# Altium schematic sheet FPGA.SchDoc
size D; DocumentNumber: 4; SheetNumber: 4; SheetTotal: 8
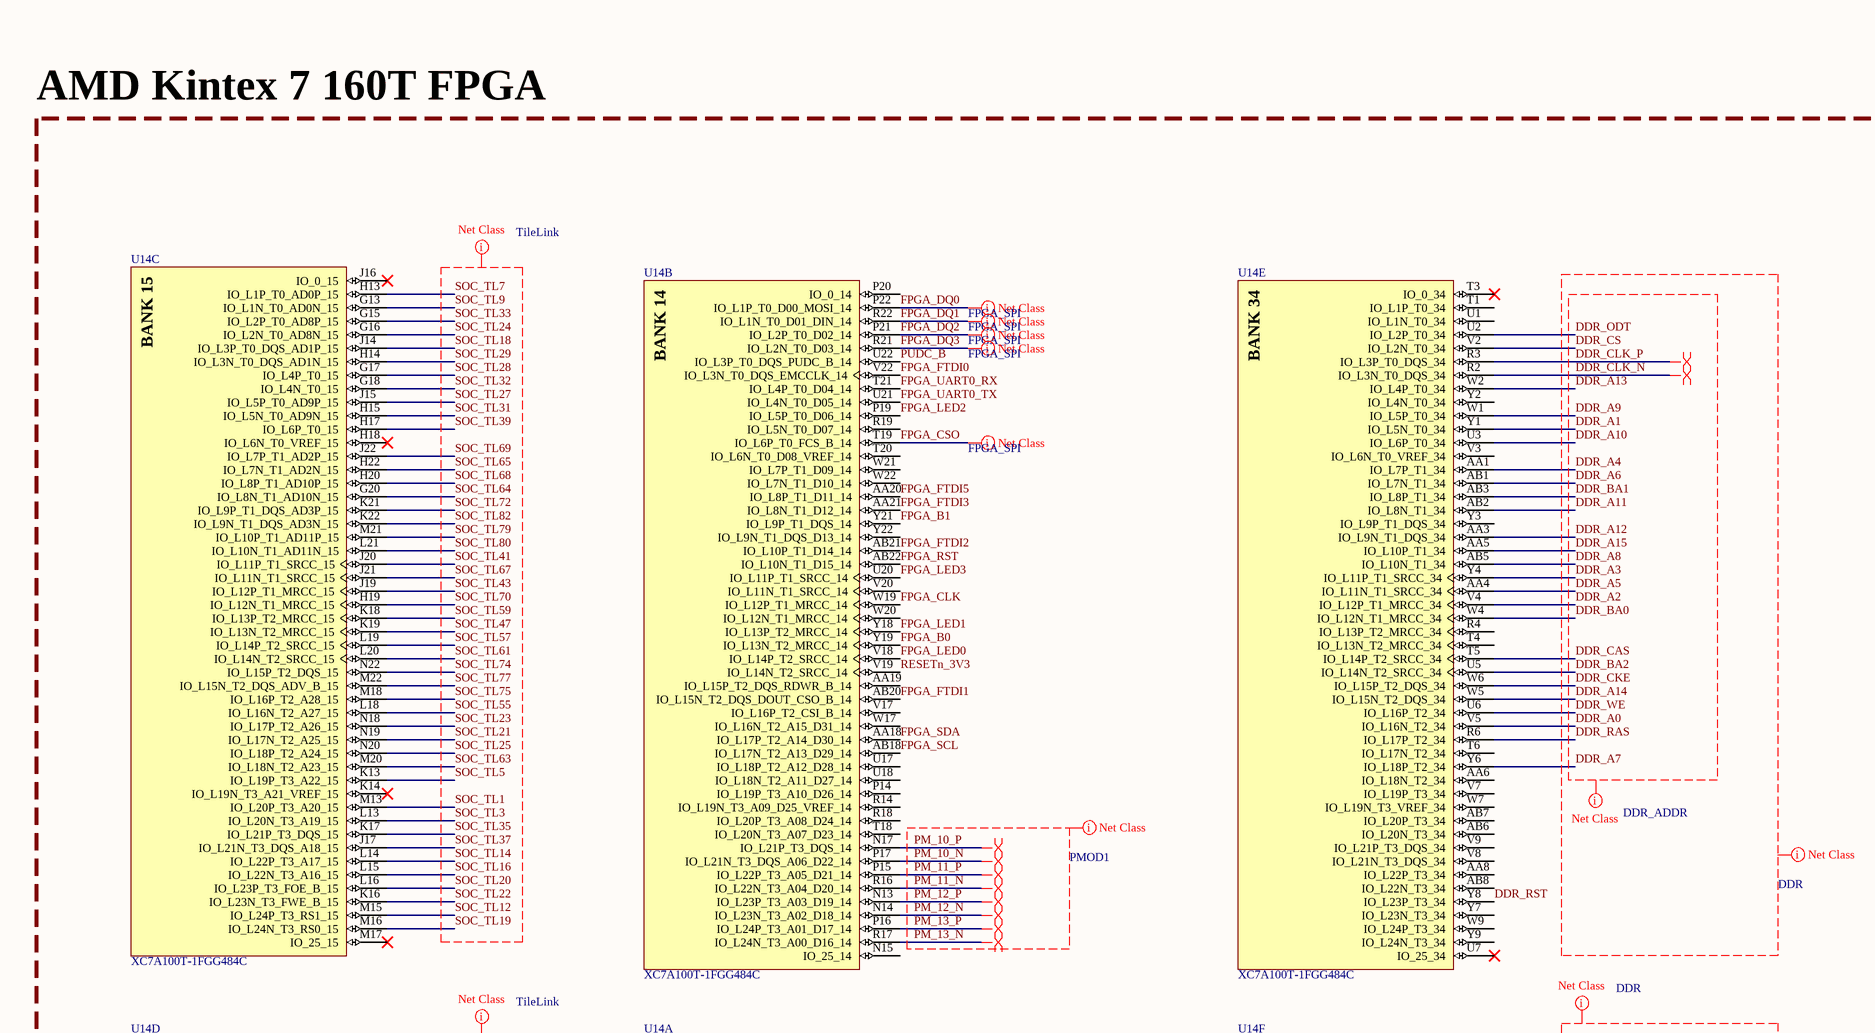
[diagram p0: FPGA.SchDoc, top left]
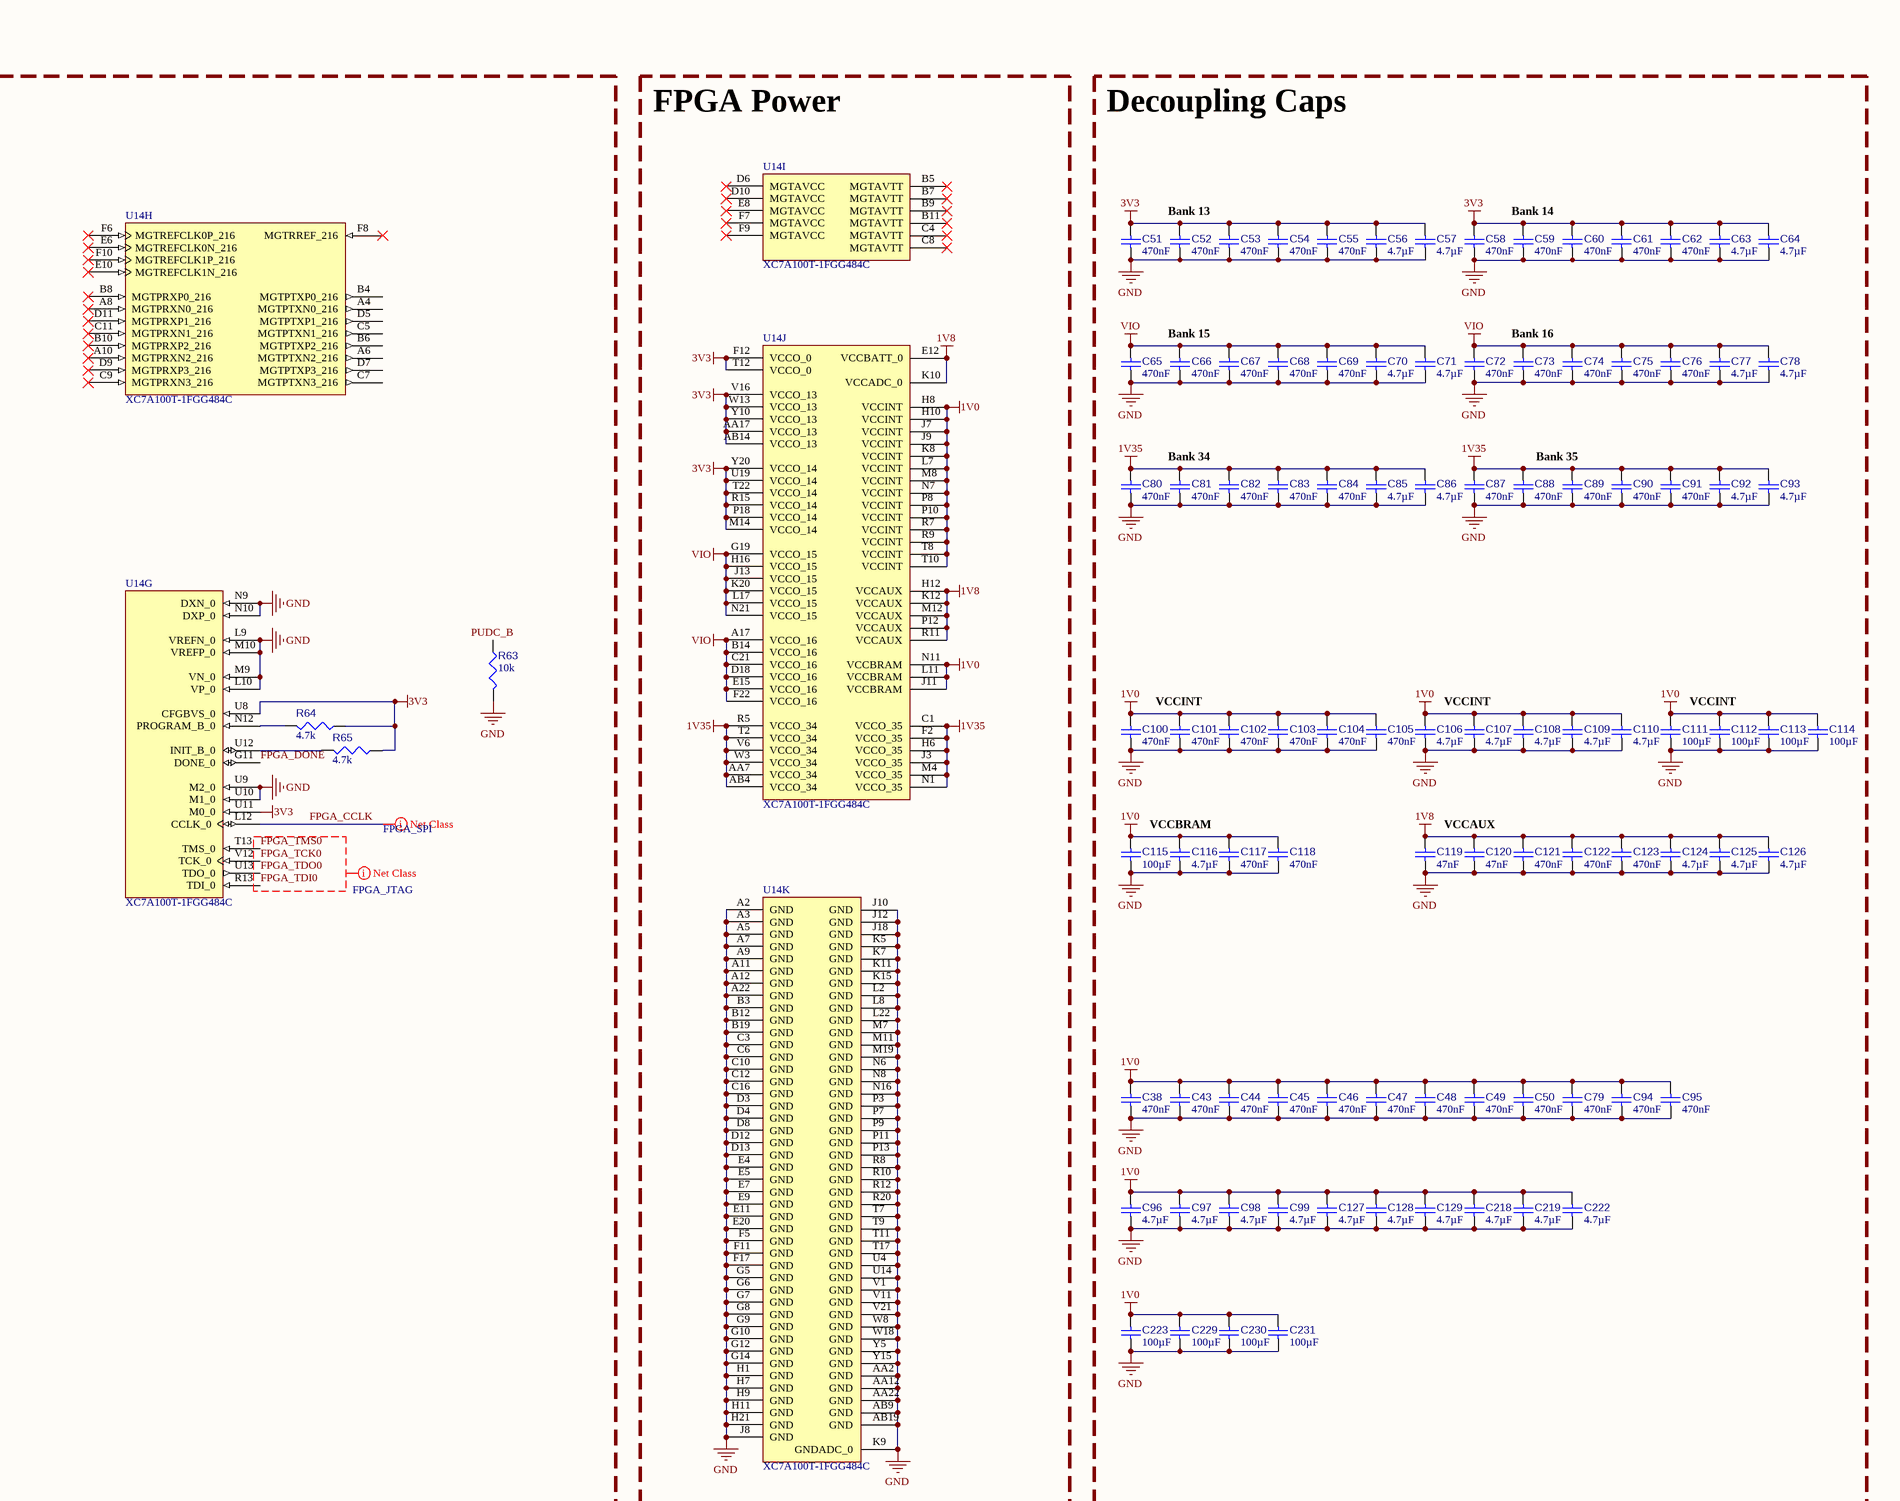
[diagram p1: FPGA.SchDoc, top right]
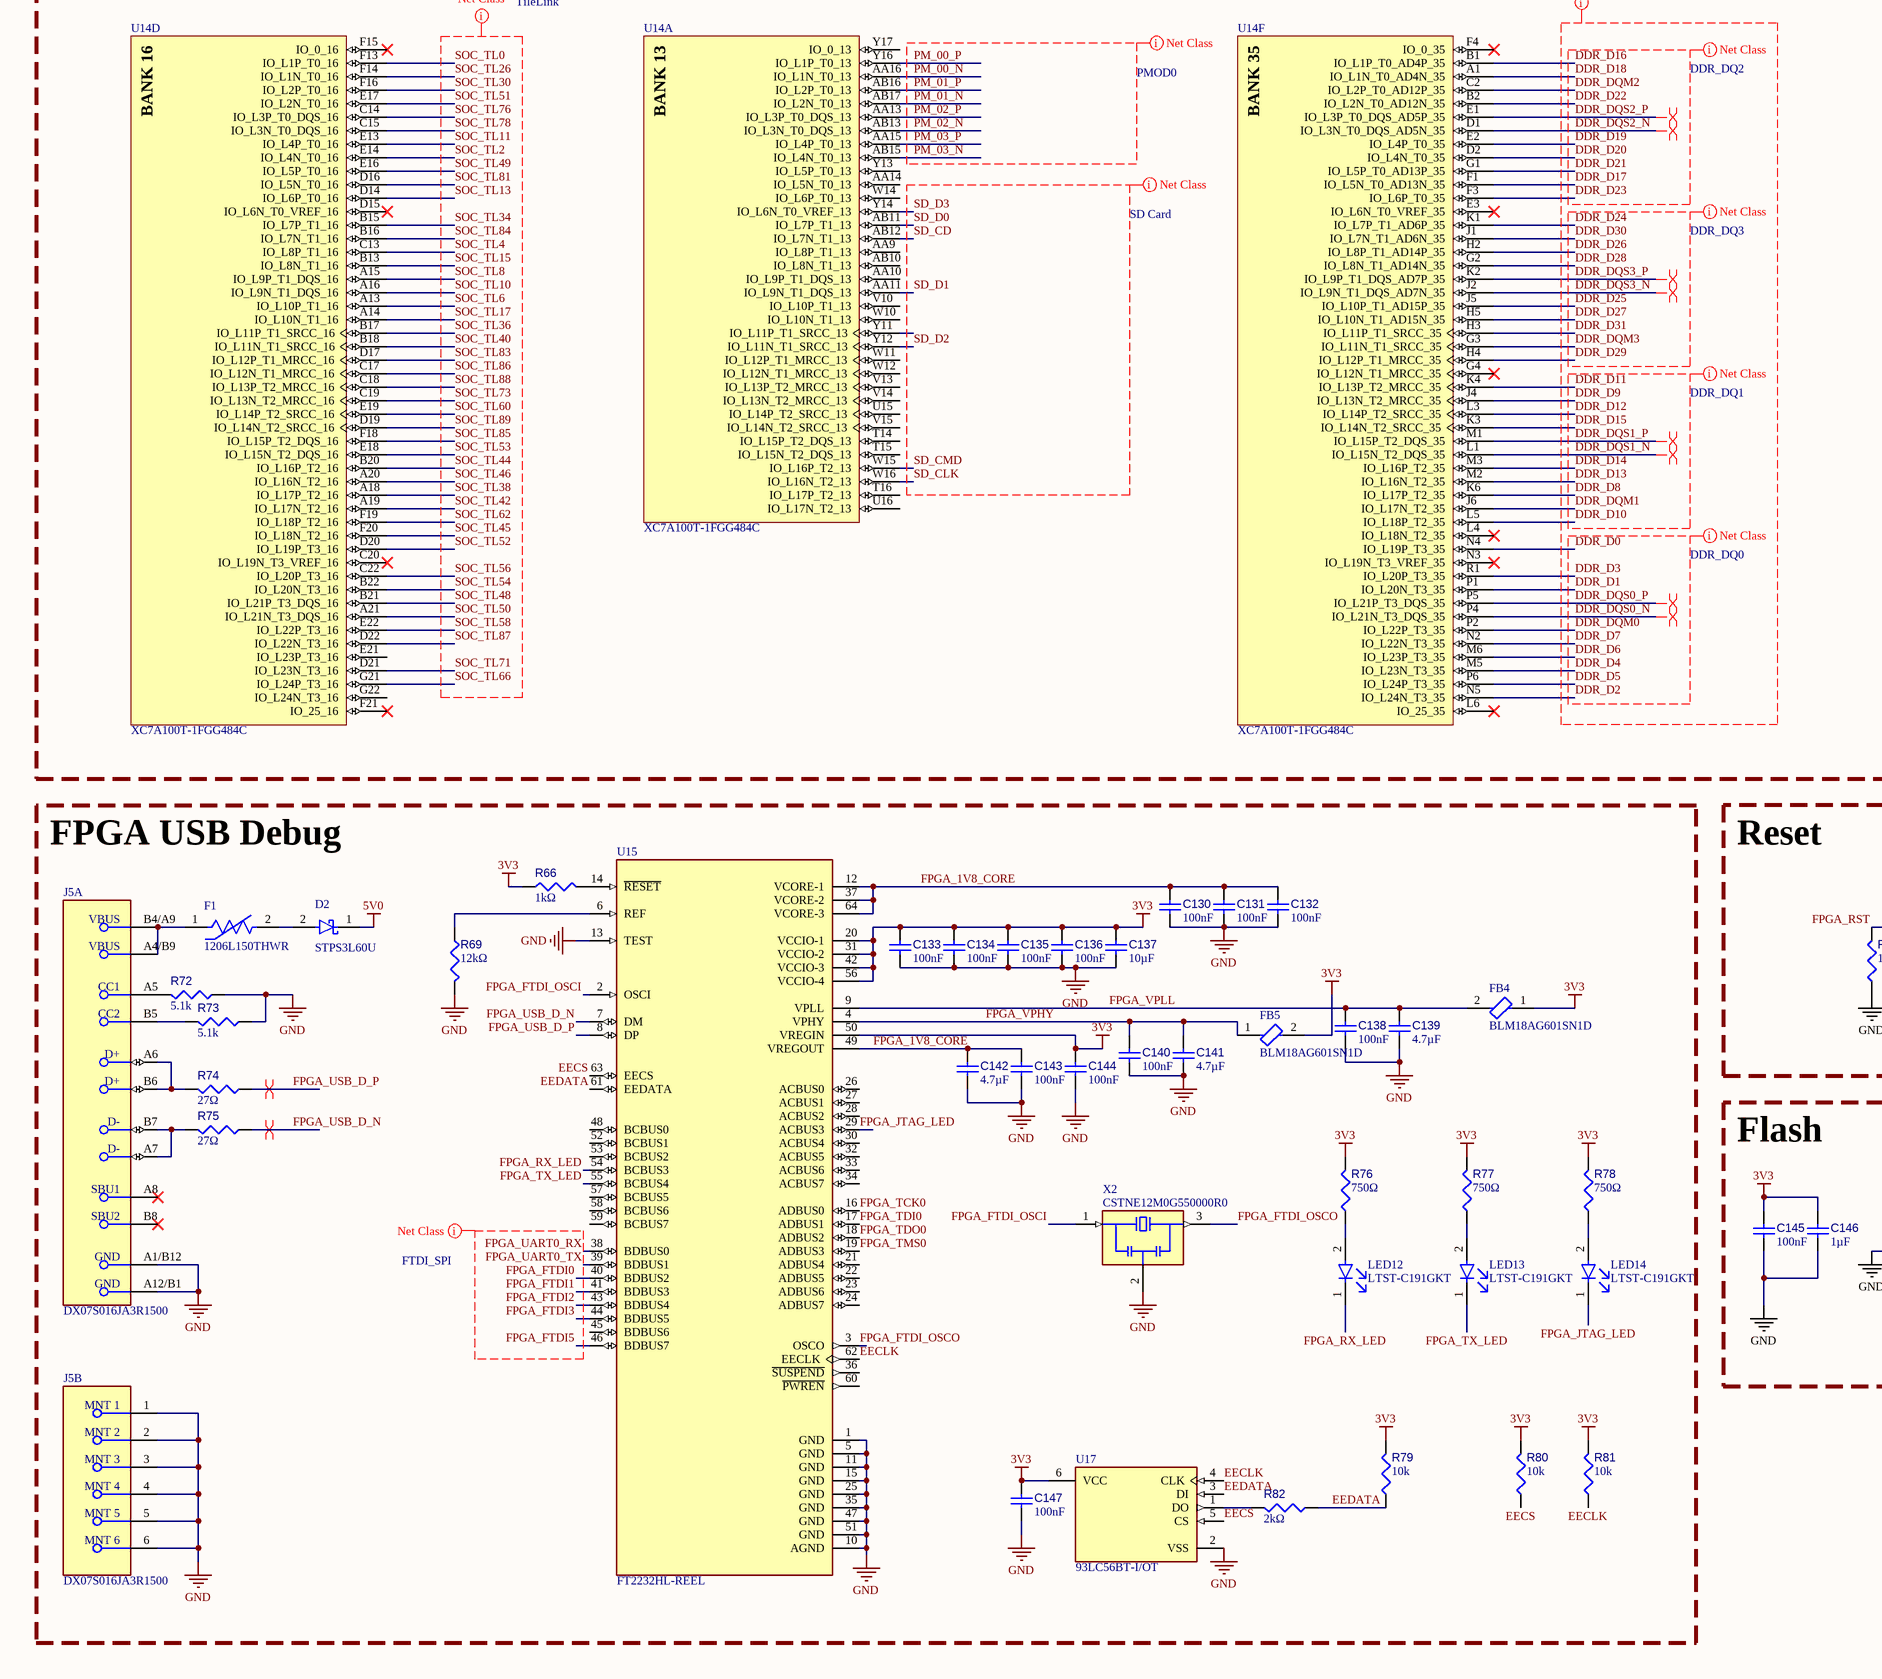
[diagram p2: FPGA.SchDoc, bottom left]
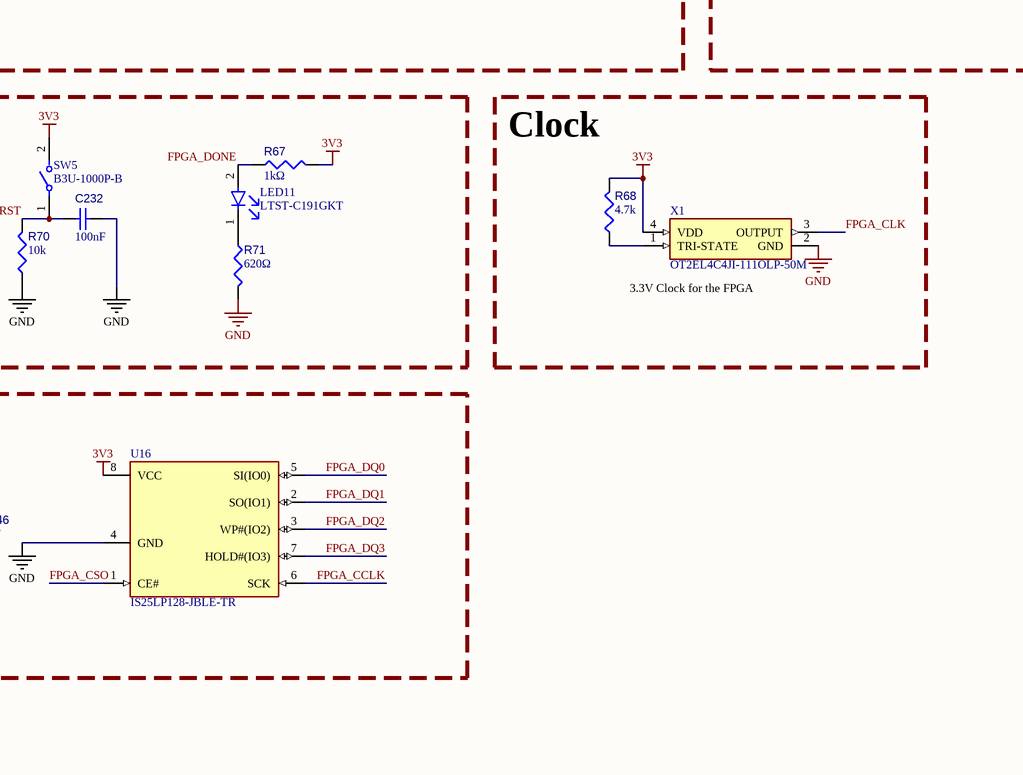
[diagram p3: FPGA.SchDoc, bottom right]

## Parts
C38  value 470nF  [CAP-0402-MFG]  (hidden comment: GRT155R61C474KE01D)
C43  value 470nF  [CAP-0402-MFG]  (hidden comment: GRT155R61C474KE01D)
C44  value 470nF  [CAP-0402-MFG]  (hidden comment: GRT155R61C474KE01D)
C45  value 470nF  [CAP-0402-MFG]  (hidden comment: GRT155R61C474KE01D)
C46  value 470nF  [CAP-0402-MFG]  (hidden comment: GRT155R61C474KE01D)
C47  value 470nF  [CAP-0402-MFG]  (hidden comment: GRT155R61C474KE01D)
C48  value 470nF  [CAP-0402-MFG]  (hidden comment: GRT155R61C474KE01D)
C49  value 470nF  [CAP-0402-MFG]  (hidden comment: GRT155R61C474KE01D)
C50  value 470nF  [CAP-0402-MFG]  (hidden comment: GRT155R61C474KE01D)
C51  value 470nF  [CAP-0402-MFG]  (hidden comment: GRT155R61C474KE01D)
C52  value 470nF  [CAP-0402-MFG]  (hidden comment: GRT155R61C474KE01D)
C53  value 470nF  [CAP-0402-MFG]  (hidden comment: GRT155R61C474KE01D)
C54  value 470nF  [CAP-0402-MFG]  (hidden comment: GRT155R61C474KE01D)
C55  value 470nF  [CAP-0402-MFG]  (hidden comment: GRT155R61C474KE01D)
C56  value 4.7µF  [CAP-0402-MFG]  (hidden comment: GRM155R61E475ME15D)
C57  value 4.7µF  [CAP-0402-MFG]  (hidden comment: GRM155R61E475ME15D)
C58  value 470nF  [CAP-0402-MFG]  (hidden comment: GRT155R61C474KE01D)
C59  value 470nF  [CAP-0402-MFG]  (hidden comment: GRT155R61C474KE01D)
C60  value 470nF  [CAP-0402-MFG]  (hidden comment: GRT155R61C474KE01D)
C61  value 470nF  [CAP-0402-MFG]  (hidden comment: GRT155R61C474KE01D)
C62  value 470nF  [CAP-0402-MFG]  (hidden comment: GRT155R61C474KE01D)
C63  value 4.7µF  [CAP-0402-MFG]  (hidden comment: GRM155R61E475ME15D)
C64  value 4.7µF  [CAP-0402-MFG]  (hidden comment: GRM155R61E475ME15D)
C65  value 470nF  [CAP-0402-MFG]  (hidden comment: GRT155R61C474KE01D)
C66  value 470nF  [CAP-0402-MFG]  (hidden comment: GRT155R61C474KE01D)
C67  value 470nF  [CAP-0402-MFG]  (hidden comment: GRT155R61C474KE01D)
C68  value 470nF  [CAP-0402-MFG]  (hidden comment: GRT155R61C474KE01D)
C69  value 470nF  [CAP-0402-MFG]  (hidden comment: GRT155R61C474KE01D)
C70  value 4.7µF  [CAP-0402-MFG]  (hidden comment: GRM155R61E475ME15D)
C71  value 4.7µF  [CAP-0402-MFG]  (hidden comment: GRM155R61E475ME15D)
C72  value 470nF  [CAP-0402-MFG]  (hidden comment: GRT155R61C474KE01D)
C73  value 470nF  [CAP-0402-MFG]  (hidden comment: GRT155R61C474KE01D)
C74  value 470nF  [CAP-0402-MFG]  (hidden comment: GRT155R61C474KE01D)
C75  value 470nF  [CAP-0402-MFG]  (hidden comment: GRT155R61C474KE01D)
C76  value 470nF  [CAP-0402-MFG]  (hidden comment: GRT155R61C474KE01D)
C77  value 4.7µF  [CAP-0402-MFG]  (hidden comment: GRM155R61E475ME15D)
C78  value 4.7µF  [CAP-0402-MFG]  (hidden comment: GRM155R61E475ME15D)
C79  value 470nF  [CAP-0402-MFG]  (hidden comment: GRT155R61C474KE01D)
C80  value 470nF  [CAP-0402-MFG]  (hidden comment: GRT155R61C474KE01D)
C81  value 470nF  [CAP-0402-MFG]  (hidden comment: GRT155R61C474KE01D)
C82  value 470nF  [CAP-0402-MFG]  (hidden comment: GRT155R61C474KE01D)
C83  value 470nF  [CAP-0402-MFG]  (hidden comment: GRT155R61C474KE01D)
C84  value 470nF  [CAP-0402-MFG]  (hidden comment: GRT155R61C474KE01D)
C85  value 4.7µF  [CAP-0402-MFG]  (hidden comment: GRM155R61E475ME15D)
C86  value 4.7µF  [CAP-0402-MFG]  (hidden comment: GRM155R61E475ME15D)
C87  value 470nF  [CAP-0402-MFG]  (hidden comment: GRT155R61C474KE01D)
C88  value 470nF  [CAP-0402-MFG]  (hidden comment: GRT155R61C474KE01D)
C89  value 470nF  [CAP-0402-MFG]  (hidden comment: GRT155R61C474KE01D)
C90  value 470nF  [CAP-0402-MFG]  (hidden comment: GRT155R61C474KE01D)
C91  value 470nF  [CAP-0402-MFG]  (hidden comment: GRT155R61C474KE01D)
C92  value 4.7µF  [CAP-0402-MFG]  (hidden comment: GRM155R61E475ME15D)
C93  value 4.7µF  [CAP-0402-MFG]  (hidden comment: GRM155R61E475ME15D)
C94  value 470nF  [CAP-0402-MFG]  (hidden comment: GRT155R61C474KE01D)
C95  value 470nF  [CAP-0402-MFG]  (hidden comment: GRT155R61C474KE01D)
C96  value 4.7µF  [CAP-0402-MFG]  (hidden comment: GRM155R61E475ME15D)
C97  value 4.7µF  [CAP-0402-MFG]  (hidden comment: GRM155R61E475ME15D)
C98  value 4.7µF  [CAP-0402-MFG]  (hidden comment: GRM155R61E475ME15D)
C99  value 4.7µF  [CAP-0402-MFG]  (hidden comment: GRM155R61E475ME15D)
C100  value 470nF  [CAP-0402-MFG]  (hidden comment: GRT155R61C474KE01D)
C101  value 470nF  [CAP-0402-MFG]  (hidden comment: GRT155R61C474KE01D)
C102  value 470nF  [CAP-0402-MFG]  (hidden comment: GRT155R61C474KE01D)
C103  value 470nF  [CAP-0402-MFG]  (hidden comment: GRT155R61C474KE01D)
C104  value 470nF  [CAP-0402-MFG]  (hidden comment: GRT155R61C474KE01D)
C105  value 470nF  [CAP-0402-MFG]  (hidden comment: GRT155R61C474KE01D)
C106  value 4.7µF  [CAP-0402-MFG]  (hidden comment: GRM155R61E475ME15D)
C107  value 4.7µF  [CAP-0402-MFG]  (hidden comment: GRM155R61E475ME15D)
C108  value 4.7µF  [CAP-0402-MFG]  (hidden comment: GRM155R61E475ME15D)
C109  value 4.7µF  [CAP-0402-MFG]  (hidden comment: GRM155R61E475ME15D)
C110  value 4.7µF  [CAP-0402-MFG]  (hidden comment: GRM155R61E475ME15D)
C111  value 100µF  [CAP-0805-MFG]  (hidden comment: GRM21BR60J107ME15L)
C112  value 100µF  [CAP-0805-MFG]  (hidden comment: GRM21BR60J107ME15L)
C113  value 100µF  [CAP-0805-MFG]  (hidden comment: GRM21BR60J107ME15L)
C114  value 100µF  [CAP-0805-MFG]  (hidden comment: GRM21BR60J107ME15L)
C115  value 100µF  [CAP-0805-MFG]  (hidden comment: GRM21BR60J107ME15L)
C116  value 4.7µF  [CAP-0402-MFG]  (hidden comment: GRM155R61E475ME15D)
C117  value 470nF  [CAP-0402-MFG]  (hidden comment: GRT155R61C474KE01D)
C118  value 470nF  [CAP-0402-MFG]  (hidden comment: GRT155R61C474KE01D)
C119  value 47nF  [CAP-0402-MFG]  (hidden comment: CL05B473KO5NNNC)
C120  value 47nF  [CAP-0402-MFG]  (hidden comment: CL05B473KO5NNNC)
C121  value 470nF  [CAP-0402-MFG]  (hidden comment: GRT155R61C474KE01D)
C122  value 470nF  [CAP-0402-MFG]  (hidden comment: GRT155R61C474KE01D)
C123  value 470nF  [CAP-0402-MFG]  (hidden comment: GRT155R61C474KE01D)
C124  value 4.7µF  [CAP-0402-MFG]  (hidden comment: GRM155R61E475ME15D)
C125  value 4.7µF  [CAP-0402-MFG]  (hidden comment: GRM155R61E475ME15D)
C126  value 4.7µF  [CAP-0402-MFG]  (hidden comment: GRM155R61E475ME15D)
C127  value 4.7µF  [CAP-0402-MFG]  (hidden comment: GRM155R61E475ME15D)
C128  value 4.7µF  [CAP-0402-MFG]  (hidden comment: GRM155R61E475ME15D)
C129  value 4.7µF  [CAP-0402-MFG]  (hidden comment: GRM155R61E475ME15D)
C130  value 100nF  [CAP-0402-MFG]  (hidden comment: CL05B104KO5VPNC)
C131  value 100nF  [CAP-0402-MFG]  (hidden comment: CL05B104KO5VPNC)
C132  value 100nF  [CAP-0402-MFG]  (hidden comment: CL05B104KO5VPNC)
C133  value 100nF  [CAP-0402-MFG]  (hidden comment: CL05B104KO5VPNC)
C134  value 100nF  [CAP-0402-MFG]  (hidden comment: CL05B104KO5VPNC)
C135  value 100nF  [CAP-0402-MFG]  (hidden comment: CL05B104KO5VPNC)
C136  value 100nF  [CAP-0402-MFG]  (hidden comment: CL05B104KO5VPNC)
C137  value 10µF  [CAP-0603-MFG]  (hidden comment: GRT188R61C106KE13J)
C138  value 100nF  [CAP-0402-MFG]  (hidden comment: CL05B104KO5VPNC)
C139  value 4.7µF  [CAP-0402-MFG]  (hidden comment: GRM155R61E475ME15D)
C140  value 100nF  [CAP-0402-MFG]  (hidden comment: CL05B104KO5VPNC)
C141  value 4.7µF  [CAP-0402-MFG]  (hidden comment: GRM155R61E475ME15D)
C142  value 4.7µF  [CAP-0402-MFG]  (hidden comment: GRM155R61E475ME15D)
C143  value 100nF  [CAP-0402-MFG]  (hidden comment: CL05B104KO5VPNC)
C144  value 100nF  [CAP-0402-MFG]  (hidden comment: CL05B104KO5VPNC)
C145  value 100nF  [CAP-0402-MFG]  (hidden comment: CL05B104KO5VPNC)
C146  value 1µF  [CAP-0402-MFG]  (hidden comment: GRT155C81C105KE13J)
C147  value 100nF  [CAP-0402-MFG]  (hidden comment: CL05B104KO5VPNC)
C218  value 4.7µF  [CAP-0402-MFG]  (hidden comment: GRM155R61E475ME15D)
C219  value 4.7µF  [CAP-0402-MFG]  (hidden comment: GRM155R61E475ME15D)
C222  value 4.7µF  [CAP-0402-MFG]  (hidden comment: GRM155R61E475ME15D)
C223  value 100µF  [CAP-0805-MFG]  (hidden comment: GRM21BR60J107ME15L)
C229  value 100µF  [CAP-0805-MFG]  (hidden comment: GRM21BR60J107ME15L)
C230  value 100µF  [CAP-0805-MFG]  (hidden comment: GRM21BR60J107ME15L)
C231  value 100µF  [CAP-0805-MFG]  (hidden comment: GRM21BR60J107ME15L)
C232  value 100nF  [CAP-0402-MFG]  (hidden comment: CL05B104KA54PNC)
D2  STPS3L60U  [FP-DO214AA-MFG]
F1  1206L150THWR  [FP-1206L050YR-MFG]
FB4  BLM18AG601SN1D  [FERRITEBEAD-0603-MFG]
FB5  BLM18AG601SN1D  [FERRITEBEAD-0603-MFG]
J5  DX07S016JA3R1500  [FP-DX07S016JA3R1500-MFG]  (parts A,B of 2)
LED11  LTST-C191GKT  [LED-0603-MFG]
LED12  LTST-C191GKT  [LED-0603-MFG]
LED13  LTST-C191GKT  [LED-0603-MFG]
LED14  LTST-C191GKT  [LED-0603-MFG]
R63  value 10k  [RES-0402]  (hidden comment: AC0402FR-0710KL)
R64  value 4.7k  [RES-0402]  (hidden comment: AC0402FR-074K7L)
R65  value 4.7k  [RES-0402]  (hidden comment: AC0402FR-074K7L)
R66  value 1kΩ  [RES-0402]  (hidden comment: AC0402FR-071KL)
R67  value 1kΩ  [RES-0402]  (hidden comment: AC0402FR-071KL)
R68  value 4.7k  [RES-0402]  (hidden comment: AC0402FR-074K7L)
R69  value 12kΩ  [RES-0402]  (hidden comment: AC0402FR-0712KL)
R70  value 10k  [RES-0402]  (hidden comment: AC0402FR-0710KL)
R71  value 620Ω  [RES-0402]  (hidden comment: AC0402FR-07620RL)
R72  value 5.1k  [RES-0402]  (hidden comment: AC0402FR-075K1L)
R73  value 5.1k  [RES-0402]  (hidden comment: AC0402FR-075K1L)
R74  value 27Ω  [RES-0402]  (hidden comment: AC0402FR-0727RL)
R75  value 27Ω  [RES-0402]  (hidden comment: AC0402FR-0727RL)
R76  value 750Ω  [RES-0402]  (hidden comment: AC0402FR-07750RL)
R77  value 750Ω  [RES-0402]  (hidden comment: AC0402FR-07750RL)
R78  value 750Ω  [RES-0402]  (hidden comment: AC0402FR-07750RL)
R79  value 10k  [RES-0402]  (hidden comment: AC0402FR-0710KL)
R80  value 10k  [RES-0402]  (hidden comment: AC0402FR-0710KL)
R81  value 10k  [RES-0402]  (hidden comment: AC0402FR-0710KL)
R82  value 2kΩ  [RES-0402]  (hidden comment: AC0402FR-072KL)
SW5  B3U-1000P-B  [FP-B3U-1000P-B-MFG]
U14  XC7A100T-1FGG484C  [FGG484]  (parts A,B,C,D,E,F,G,H,I,J,K of 11)
U15  FT2232HL-REEL  [LQFP-64-MFG]
U16  IS25LP128-JBLE-TR  [FP-SOIC8-MFG]
U17  93LC56BT-I/OT  [FP-SOT-23-6-MFG]
X1  OT2EL4C4JI-111OLP-50M  [OSC_SMD3225-4P]
X2  CSTNE12M0G550000R0  [OSC-SMD3213-3P]

## Blocks framed on the sheet
FPGA Power: U14
Decoupling Caps: C38 C43-C129 C218 C219 C222 C223 C229-C231
FPGA USB Debug: C130-C144 C147 D2 F1 FB4 FB5 J5 LED12-LED14 R66 R69 R72-R82 U15 U17 X2
Reset: C232 LED11 R67 R70 R71 SW5
Clock: R68 X1
Flash: C145 C146 U16

## Nets
1V0: C38.1 C43.1 C44.1 C45.1 C46.2 C47.2 C48.2 C49.1 C50.2 C79.1 C94.1 C95.1 C96.1 C97.1 C98.1 C99.1 C100.1 C101.1 C102.1 C103.1 C104.2 C105.1 C106.1 C107.1 C108.2 C109.2 C110.1 C111.1 C112.1 C113.1 C114.1 C115.1 C116.1 C117.2 C118.1 C127.1 C128.1 C129.1 C218.1 C219.2 C222.1 C223.1 C229.1 C230.1 C231.1 U14.H8(VCCINT) U14.H10(VCCINT) U14.J7(VCCINT) U14.J9(VCCINT) U14.J11(VCCBRAM) U14.K8(VCCINT) U14.L7(VCCINT) U14.L11(VCCBRAM) U14.M8(VCCINT) U14.N7(VCCINT) U14.N11(VCCBRAM) U14.P8(VCCINT) U14.P10(VCCINT) U14.R7(VCCINT) U14.R9(VCCINT) U14.T8(VCCINT) U14.T10(VCCINT)
1V8: C119.1 C120.1 C121.1 C122.1 C123.1 C124.1 C125.1 C126.1 U14.E12(VCCBATT_0) U14.H12(VCCAUX) U14.K10(VCCADC_0) U14.K12(VCCAUX) U14.M12(VCCAUX) U14.P12(VCCAUX) U14.R11(VCCAUX)
1V35: C80.1 C81.1 C82.1 C83.1 C84.1 C85.1 C86.1 C87.1 C88.1 C89.1 C90.1 C91.1 C92.1 C93.1 U14.AA7(VCCO_34) U14.AB4(VCCO_34) U14.C1(VCCO_35) U14.F2(VCCO_35) U14.H6(VCCO_35) U14.J3(VCCO_35) U14.M4(VCCO_35) U14.N1(VCCO_35) U14.R5(VCCO_34) U14.T2(VCCO_34) U14.V6(VCCO_34) U14.W3(VCCO_34)
3V3: C51.1 C52.1 C53.1 C54.1 C55.1 C56.1 C57.1 C58.1 C59.1 C60.1 C61.1 C62.1 C63.1 C64.1 C133.1 C134.1 C135.1 C136.1 C137.1 C144.1 C145.1 C146.1 C147.2 FB4.1 FB5.2 R64.1 R65.1 R66.1 R67.2 R68.2 R76.2 R77.2 R78.2 R79.2 R80.2 R81.2 SW5.2 U14.AA17(VCCO_13) U14.AB14(VCCO_13) U14.F12(VCCO_0) U14.M14(VCCO_14) U14.P18(VCCO_14) U14.R15(VCCO_14) U14.T12(VCCO_0) U14.T22(VCCO_14) U14.U8(CFGBVS_0) U14.U11(M0_0) U14.U19(VCCO_14) U14.V16(VCCO_13) U14.W13(VCCO_13) U14.Y10(VCCO_13) U14.Y20(VCCO_14) U15.20(VCCIO-1) U15.31(VCCIO-2) U15.42(VCCIO-3) U15.50(VREGIN) U15.56(VCCIO-4) U16.8(VCC) U17.6(VCC) X1.4(VDD)
5V0: D2.1(K)
GND: C38.2 C43.2 C44.2 C45.2 C46.1 C47.1 C48.1 C49.2 C50.1 C51.2 C52.2 C53.2 C54.2 C55.2 C56.2 C57.2 C58.2 C59.2 C60.2 C61.2 C62.2 C63.2 C64.2 C65.2 C66.2 C67.2 C68.2 C69.2 C70.2 C71.2 C72.2 C73.2 C74.2 C75.2 C76.2 C77.2 C78.2 C79.2 C80.2 C81.2 C82.2 C83.2 C84.2 C85.2 C86.2 C87.2 C88.2 C89.2 C90.2 C91.2 C92.2 C93.2 C94.2 C95.2 C96.2 C97.2 C98.2 C99.2 C100.2 C101.2 C102.2 C103.2 C104.1 C105.2 C106.2 C107.2 C108.1 C109.1 C110.2 C111.2 C112.2 C113.2 C114.2 C115.2 C116.2 C117.1 C118.2 C119.2 C120.2 C121.2 C122.2 C123.2 C124.2 C125.2 C126.2 C127.2 C128.2 C129.2 C130.2 C131.2 C132.2 C133.2 C134.2 C135.2 C136.2 C137.2 C138.2 C139.2 C140.2 C141.2 C142.2 C143.2 C144.2 C145.2 C146.2 C147.1 C218.2 C219.1 C222.2 C223.2 C229.2 C230.2 C231.2 C232.2 J5.1(MNT_1) J5.2(MNT_2) J5.3(MNT_3) J5.4(MNT_4) J5.5(MNT_5) J5.6(MNT_6) J5.A1/B12(GND) J5.A12/B1(GND) R63.2 R69.2 R70.1 R71.2 R72.1 R73.1 U14.A2(GND) U14.A3(GND) U14.A5(GND) U14.A7(GND) U14.A9(GND) U14.A11(GND) U14.A12(GND) U14.A22(GND) U14.AA2(GND) U14.AA12(GND) U14.AA22(GND) U14.AB9(GND) U14.AB19(GND) U14.B3(GND) U14.B12(GND) U14.B19(GND) U14.C3(GND) U14.C6(GND) U14.C10(GND) U14.C12(GND) U14.C16(GND) U14.D3(GND) U14.D4(GND) U14.D8(GND) U14.D12(GND) U14.D13(GND) U14.E4(GND) U14.E5(GND) U14.E7(GND) U14.E9(GND) U14.E11(GND) U14.E20(GND) U14.F5(GND) U14.F11(GND) U14.F17(GND) U14.G5(GND) U14.G6(GND) U14.G7(GND) U14.G8(GND) U14.G9(GND) U14.G10(GND) U14.G12(GND) U14.G14(GND) U14.H1(GND) U14.H7(GND) U14.H9(GND) U14.H11(GND) U14.H21(GND) U14.J8(GND) U14.J10(GND) U14.J12(GND) U14.J18(GND) U14.K5(GND) U14.K7(GND) U14.K9(GNDADC_0) U14.K11(GND) U14.K15(GND) U14.L2(GND) U14.L8(GND) U14.L9(VREFN_0) U14.L10(VP_0) U14.L22(GND) U14.M7(GND) U14.M9(VN_0) U14.M10(VREFP_0) U14.M11(GND) U14.M19(GND) U14.N6(GND) U14.N8(GND) U14.N9(DXN_0) U14.N10(DXP_0) U14.N16(GND) U14.P3(GND) U14.P7(GND) U14.P9(GND) U14.P11(GND) U14.P13(GND) U14.R8(GND) U14.R10(GND) U14.R12(GND) U14.R20(GND) U14.T7(GND) U14.T9(GND) U14.T11(GND) U14.T17(GND) U14.U4(GND) U14.U9(M2_0) U14.U10(M1_0) U14.U14(GND) U14.V1(GND) U14.V11(GND) U14.V21(GND) U14.W8(GND) U14.W18(GND) U14.Y5(GND) U14.Y15(GND) U15.1(GND) U15.5(GND) U15.10(AGND) U15.11(GND) U15.13(TEST) U15.15(GND) U15.25(GND) U15.35(GND) U15.47(GND) U15.51(GND) U16.4(GND) U17.2(VSS) X1.2(GND) X2.2(GND)
VIO: C65.1 C66.1 C67.1 C68.1 C69.1 C70.1 C71.1 C72.1 C73.1 C74.1 C75.1 C76.1 C77.1 C78.1 U14.A17(VCCO_16) U14.B14(VCCO_16) U14.C21(VCCO_16) U14.D18(VCCO_16) U14.E15(VCCO_16) U14.F22(VCCO_16) U14.G19(VCCO_15) U14.H16(VCCO_15) U14.J13(VCCO_15) U14.K20(VCCO_15) U14.L17(VCCO_15) U14.N21(VCCO_15)
DDR_A0: U14.V5(IO_L16N_T2_34)
DDR_A1: U14.Y1(IO_L5N_T0_34)
DDR_A2: U14.V4(IO_L12P_T1_MRCC_34)
DDR_A3: U14.Y4(IO_L11P_T1_SRCC_34)
DDR_A4: U14.AA1(IO_L7P_T1_34)
DDR_A5: U14.AA4(IO_L11N_T1_SRCC_34)
DDR_A6: U14.AB1(IO_L7N_T1_34)
DDR_A7: U14.Y6(IO_L18P_T2_34)
DDR_A8: U14.AB5(IO_L10N_T1_34)
DDR_A9: U14.W1(IO_L5P_T0_34)
DDR_A10: U14.U3(IO_L6P_T0_34)
DDR_A11: U14.AB2(IO_L8N_T1_34)
DDR_A12: U14.AA3(IO_L9N_T1_DQS_34)
DDR_A13: U14.W2(IO_L4P_T0_34)
DDR_A14: U14.W5(IO_L15N_T2_DQS_34)
DDR_A15: U14.AA5(IO_L10P_T1_34)
DDR_BA0: U14.W4(IO_L12N_T1_MRCC_34)
DDR_BA1: U14.AB3(IO_L8P_T1_34)
DDR_BA2: U14.U5(IO_L14N_T2_SRCC_34)
DDR_CAS: U14.T5(IO_L14P_T2_SRCC_34)
DDR_CKE: U14.W6(IO_L15P_T2_DQS_34)
DDR_CLK_N: U14.R2(IO_L3N_T0_DQS_34)
DDR_CLK_P: U14.R3(IO_L3P_T0_DQS_34)
DDR_CS: U14.V2(IO_L2N_T0_34)
DDR_D0: U14.N4(IO_L19P_T3_35)
DDR_D1: U14.P1(IO_L20N_T3_35)
DDR_D2: U14.N5(IO_L24N_T3_35)
DDR_D3: U14.R1(IO_L20P_T3_35)
DDR_D4: U14.M5(IO_L23N_T3_35)
DDR_D5: U14.P6(IO_L24P_T3_35)
DDR_D6: U14.M6(IO_L23P_T3_35)
DDR_D7: U14.N2(IO_L22N_T3_35)
DDR_D8: U14.K6(IO_L17P_T2_35)
DDR_D9: U14.J4(IO_L13N_T2_MRCC_35)
DDR_D10: U14.L5(IO_L18P_T2_35)
DDR_D11: U14.K4(IO_L13P_T2_MRCC_35)
DDR_D12: U14.L3(IO_L14P_T2_SRCC_35)
DDR_D13: U14.M2(IO_L16N_T2_35)
DDR_D14: U14.M3(IO_L16P_T2_35)
DDR_D15: U14.K3(IO_L14N_T2_SRCC_35)
DDR_D16: U14.B1(IO_L1P_T0_AD4P_35)
DDR_D17: U14.F1(IO_L5N_T0_AD13N_35)
DDR_D18: U14.A1(IO_L1N_T0_AD4N_35)
DDR_D19: U14.E2(IO_L4P_T0_35)
DDR_D20: U14.D2(IO_L4N_T0_35)
DDR_D21: U14.G1(IO_L5P_T0_AD13P_35)
DDR_D22: U14.B2(IO_L2N_T0_AD12N_35)
DDR_D23: U14.F3(IO_L6P_T0_35)
DDR_D24: U14.K1(IO_L7P_T1_AD6P_35)
DDR_D25: U14.J5(IO_L10P_T1_AD15P_35)
DDR_D26: U14.H2(IO_L8P_T1_AD14P_35)
DDR_D27: U14.H5(IO_L10N_T1_AD15N_35)
DDR_D28: U14.G2(IO_L8N_T1_AD14N_35)
DDR_D29: U14.H4(IO_L12P_T1_MRCC_35)
DDR_D30: U14.J1(IO_L7N_T1_AD6N_35)
DDR_D31: U14.H3(IO_L11P_T1_SRCC_35)
DDR_DQM0: U14.P2(IO_L22P_T3_35)
DDR_DQM1: U14.J6(IO_L17N_T2_35)
DDR_DQM2: U14.C2(IO_L2P_T0_AD12P_35)
DDR_DQM3: U14.G3(IO_L11N_T1_SRCC_35)
DDR_DQS0_N: U14.P4(IO_L21N_T3_DQS_35)
DDR_DQS0_P: U14.P5(IO_L21P_T3_DQS_35)
DDR_DQS1_N: U14.L1(IO_L15N_T2_DQS_35)
DDR_DQS1_P: U14.M1(IO_L15P_T2_DQS_35)
DDR_DQS2_N: U14.D1(IO_L3N_T0_DQS_AD5N_35)
DDR_DQS2_P: U14.E1(IO_L3P_T0_DQS_AD5P_35)
DDR_DQS3_N: U14.J2(IO_L9N_T1_DQS_AD7N_35)
DDR_DQS3_P: U14.K2(IO_L9P_T1_DQS_AD7P_35)
DDR_ODT: U14.U2(IO_L2P_T0_34)
DDR_RAS: U14.R6(IO_L17P_T2_34)
DDR_RST: U14.Y8(IO_L23P_T3_34)
DDR_WE: U14.U6(IO_L16P_T2_34)
EECLK: R81.1 U15.62(EECLK) U17.4(CLK)
EECS: R80.1 U15.63(EECS) U17.5(CS)
EEDATA: R79.1 R82.1 U15.61(EEDATA) U17.3(DI)
FPGA_1V8_CORE: C130.1 C131.1 C132.1 C142.1 C143.1 U15.12(VCORE-1) U15.37(VCORE-2) U15.49(VREGOUT) U15.64(VCORE-3)
FPGA_B0: U14.Y19(IO_L13N_T2_MRCC_14)
FPGA_B1: U14.Y21(IO_L9P_T1_DQS_14)
FPGA_CCLK: U14.L12(CCLK_0) U16.6(SCK)
FPGA_CLK: U14.W19(IO_L12P_T1_MRCC_14) X1.3(OUTPUT)
FPGA_CSO: U14.T19(IO_L6P_T0_FCS_B_14) U16.1(CE#)
FPGA_DONE: LED11.2(A) R67.1 U14.G11(DONE_0)
FPGA_DQ0: U14.P22(IO_L1P_T0_D00_MOSI_14) U16.5(SI(IO0))
FPGA_DQ1: U14.R22(IO_L1N_T0_D01_DIN_14) U16.2(SO(IO1))
FPGA_DQ2: U14.P21(IO_L2P_T0_D02_14) U16.3(WP#(IO2))
FPGA_DQ3: U14.R21(IO_L2N_T0_D03_14) U16.7(HOLD#(IO3))
FPGA_FTDI0: U14.V22(IO_L3N_T0_DQS_EMCCLK_14) U15.40(BDBUS2)
FPGA_FTDI1: U14.AB20(IO_L15N_T2_DQS_DOUT_CSO_B_14) U15.41(BDBUS3)
FPGA_FTDI2: U14.AB21(IO_L10P_T1_D14_14) U15.43(BDBUS4)
FPGA_FTDI3: U14.AA21(IO_L8N_T1_D12_14) U15.44(BDBUS5)
FPGA_FTDI5: U14.AA20(IO_L8P_T1_D11_14) U15.46(BDBUS7)
FPGA_FTDI_OSCI: U15.2(OSCI) X2.1(IN)
FPGA_FTDI_OSCO: U15.3(OSCO) X2.3(OUT)
FPGA_JTAG_LED: LED14.1(C) U15.29(ACBUS3)
FPGA_LED0: U14.V18(IO_L14P_T2_SRCC_14)
FPGA_LED1: U14.Y18(IO_L13P_T2_MRCC_14)
FPGA_LED2: U14.P19(IO_L5P_T0_D06_14)
FPGA_LED3: U14.U20(IO_L11P_T1_SRCC_14)
FPGA_RST: C232.1 R70.2 SW5.1 U14.AB22(IO_L10N_T1_D15_14)
FPGA_RX_LED: LED12.1(C) U15.54(BCBUS3)
FPGA_SCL: U14.AB18(IO_L17N_T2_A13_D29_14)
FPGA_SDA: U14.AA18(IO_L17P_T2_A14_D30_14)
FPGA_TCK0: U14.V12(TCK_0) U15.16(ADBUS0)
FPGA_TDI0: U14.R13(TDI_0) U15.17(ADBUS1)
FPGA_TDO0: U14.U13(TDO_0) U15.18(ADBUS2)
FPGA_TMS0: U14.T13(TMS_0) U15.19(ADBUS3)
FPGA_TX_LED: LED13.1(C) U15.55(BCBUS4)
FPGA_UART0_RX: U14.T21(IO_L4P_T0_D04_14) U15.38(BDBUS0)
FPGA_UART0_TX: U14.U21(IO_L4N_T0_D05_14) U15.39(BDBUS1)
FPGA_USB_D_N: R75.1 U15.7(DM)
FPGA_USB_D_P: R74.1 U15.8(DP)
FPGA_VPHY: C140.1 C141.1 FB5.1 U15.4(VPHY)
FPGA_VPLL: C138.1 C139.1 FB4.2 U15.9(VPLL)
PM_00_N: U14.AA16(IO_L1N_T0_13)
PM_00_P: U14.Y16(IO_L1P_T0_13)
PM_01_N: U14.AB17(IO_L2N_T0_13)
PM_01_P: U14.AB16(IO_L2P_T0_13)
PM_02_N: U14.AB13(IO_L3N_T0_DQS_13)
PM_02_P: U14.AA13(IO_L3P_T0_DQS_13)
PM_03_N: U14.AB15(IO_L4N_T0_13)
PM_03_P: U14.AA15(IO_L4P_T0_13)
PM_10_N: U14.P17(IO_L21N_T3_DQS_A06_D22_14)
PM_10_P: U14.N17(IO_L21P_T3_DQS_14)
PM_11_N: U14.R16(IO_L22N_T3_A04_D20_14)
PM_11_P: U14.P15(IO_L22P_T3_A05_D21_14)
PM_12_N: U14.N14(IO_L23N_T3_A02_D18_14)
PM_12_P: U14.N13(IO_L23P_T3_A03_D19_14)
PM_13_N: U14.R17(IO_L24N_T3_A00_D16_14)
PM_13_P: U14.P16(IO_L24P_T3_A01_D17_14)
PUDC_B: R63.1 U14.U22(IO_L3P_T0_DQS_PUDC_B_14)
RESETn_3V3: U14.V19(IO_L14N_T2_SRCC_14)
SD_CD: U14.AB12(IO_L7N_T1_13)
SD_CLK: U14.W16(IO_L16N_T2_13)
SD_CMD: U14.W15(IO_L16P_T2_13)
SD_D0: U14.AB11(IO_L7P_T1_13)
SD_D1: U14.AA11(IO_L9N_T1_DQS_13)
SD_D2: U14.Y12(IO_L11N_T1_SRCC_13)
SD_D3: U14.Y14(IO_L6N_T0_VREF_13)
SOC_TL0: U14.F13(IO_L1P_T0_16)
SOC_TL1: U14.M13(IO_L20P_T3_A20_15)
SOC_TL2: U14.E14(IO_L4N_T0_16)
SOC_TL3: U14.L13(IO_L20N_T3_A19_15)
SOC_TL4: U14.C13(IO_L8P_T1_16)
SOC_TL5: U14.K13(IO_L19P_T3_A22_15)
SOC_TL6: U14.A13(IO_L10P_T1_16)
SOC_TL7: U14.H13(IO_L1P_T0_AD0P_15)
SOC_TL8: U14.A15(IO_L9P_T1_DQS_16)
SOC_TL9: U14.G13(IO_L1N_T0_AD0N_15)
SOC_TL10: U14.A16(IO_L9N_T1_DQS_16)
SOC_TL11: U14.E13(IO_L4P_T0_16)
SOC_TL12: U14.M15(IO_L24P_T3_RS1_15)
SOC_TL13: U14.D14(IO_L6P_T0_16)
SOC_TL14: U14.L14(IO_L22P_T3_A17_15)
SOC_TL15: U14.B13(IO_L8N_T1_16)
SOC_TL16: U14.L15(IO_L22N_T3_A16_15)
SOC_TL17: U14.A14(IO_L10N_T1_16)
SOC_TL18: U14.J14(IO_L3P_T0_DQS_AD1P_15)
SOC_TL19: U14.M16(IO_L24N_T3_RS0_15)
SOC_TL20: U14.L16(IO_L23P_T3_FOE_B_15)
SOC_TL21: U14.N19(IO_L17N_T2_A25_15)
SOC_TL22: U14.K16(IO_L23N_T3_FWE_B_15)
SOC_TL23: U14.N18(IO_L17P_T2_A26_15)
SOC_TL24: U14.G16(IO_L2N_T0_AD8N_15)
SOC_TL25: U14.N20(IO_L18P_T2_A24_15)
SOC_TL26: U14.F14(IO_L1N_T0_16)
SOC_TL27: U14.J15(IO_L5P_T0_AD9P_15)
SOC_TL28: U14.G17(IO_L4P_T0_15)
SOC_TL29: U14.H14(IO_L3N_T0_DQS_AD1N_15)
SOC_TL30: U14.F16(IO_L2P_T0_16)
SOC_TL31: U14.H15(IO_L5N_T0_AD9N_15)
SOC_TL32: U14.G18(IO_L4N_T0_15)
SOC_TL33: U14.G15(IO_L2P_T0_AD8P_15)
SOC_TL34: U14.B15(IO_L7P_T1_16)
SOC_TL35: U14.K17(IO_L21P_T3_DQS_15)
SOC_TL36: U14.B17(IO_L11P_T1_SRCC_16)
SOC_TL37: U14.J17(IO_L21N_T3_DQS_A18_15)
SOC_TL38: U14.A18(IO_L17P_T2_16)
SOC_TL39: U14.H17(IO_L6P_T0_15)
SOC_TL40: U14.B18(IO_L11N_T1_SRCC_16)
SOC_TL41: U14.J20(IO_L11P_T1_SRCC_15)
SOC_TL42: U14.A19(IO_L17N_T2_16)
SOC_TL43: U14.J19(IO_L12P_T1_MRCC_15)
SOC_TL44: U14.B20(IO_L16P_T2_16)
SOC_TL45: U14.F20(IO_L18N_T2_16)
SOC_TL46: U14.A20(IO_L16N_T2_16)
SOC_TL47: U14.K19(IO_L13N_T2_MRCC_15)
SOC_TL48: U14.B21(IO_L21P_T3_DQS_16)
SOC_TL49: U14.E16(IO_L5P_T0_16)
SOC_TL50: U14.A21(IO_L21N_T3_DQS_16)
SOC_TL51: U14.E17(IO_L2N_T0_16)
SOC_TL52: U14.D20(IO_L19P_T3_16)
SOC_TL53: U14.E18(IO_L15N_T2_DQS_16)
SOC_TL54: U14.B22(IO_L20N_T3_16)
SOC_TL55: U14.L18(IO_L16N_T2_A27_15)
SOC_TL56: U14.C22(IO_L20P_T3_16)
SOC_TL57: U14.L19(IO_L14P_T2_SRCC_15)
SOC_TL58: U14.E22(IO_L22P_T3_16)
SOC_TL59: U14.K18(IO_L13P_T2_MRCC_15)
SOC_TL60: U14.E19(IO_L14P_T2_SRCC_16)
SOC_TL61: U14.L20(IO_L14N_T2_SRCC_15)
SOC_TL62: U14.F19(IO_L18P_T2_16)
SOC_TL63: U14.M20(IO_L18N_T2_A23_15)
SOC_TL64: U14.G20(IO_L8N_T1_AD10N_15)
SOC_TL65: U14.H22(IO_L7N_T1_AD2N_15)
SOC_TL66: U14.G21(IO_L24P_T3_16)
SOC_TL67: U14.J21(IO_L11N_T1_SRCC_15)
SOC_TL68: U14.H20(IO_L8P_T1_AD10P_15)
SOC_TL69: U14.J22(IO_L7P_T1_AD2P_15)
SOC_TL70: U14.H19(IO_L12N_T1_MRCC_15)
SOC_TL71: U14.D21(IO_L23N_T3_16)
SOC_TL72: U14.K21(IO_L9P_T1_DQS_AD3P_15)
SOC_TL73: U14.C19(IO_L13N_T2_MRCC_16)
SOC_TL74: U14.N22(IO_L15P_T2_DQS_15)
SOC_TL75: U14.M18(IO_L16P_T2_A28_15)
SOC_TL76: U14.C14(IO_L3P_T0_DQS_16)
SOC_TL77: U14.M22(IO_L15N_T2_DQS_ADV_B_15)
SOC_TL78: U14.C15(IO_L3N_T0_DQS_16)
SOC_TL79: U14.M21(IO_L10P_T1_AD11P_15)
SOC_TL80: U14.L21(IO_L10N_T1_AD11N_15)
SOC_TL81: U14.D16(IO_L5N_T0_16)
SOC_TL82: U14.K22(IO_L9N_T1_DQS_AD3N_15)
SOC_TL83: U14.D17(IO_L12P_T1_MRCC_16)
SOC_TL84: U14.B16(IO_L7N_T1_16)
SOC_TL85: U14.F18(IO_L15P_T2_DQS_16)
SOC_TL86: U14.C17(IO_L12N_T1_MRCC_16)
SOC_TL87: U14.D22(IO_L22N_T3_16)
SOC_TL88: U14.C18(IO_L13P_T2_MRCC_16)
SOC_TL89: U14.D19(IO_L14N_T2_SRCC_16)
NetD2_2: D2.2(A) F1.2
NetF1_1: F1.1 J5.A4/B9(VBUS) J5.B4/A9(VBUS)
NetJ5_A5: J5.A5(CC1) R72.2
NetJ5_A6: J5.A6(D+) J5.B6(D+) R74.2
NetJ5_A7: J5.A7(D-) J5.B7(D-) R75.2
NetJ5_B5: J5.B5(CC2) R73.2
NetLED11_1: LED11.1(C) R71.1
NetLED12_2: LED12.2(A) R76.1
NetLED13_2: LED13.2(A) R77.1
NetLED14_2: LED14.2(A) R78.1
NetR64_2: R64.2 U14.N12(PROGRAM_B_0)
NetR65_2: R65.2 U14.U12(INIT_B_0)
NetR66_2: R66.2 U15.14(~{RESET})
NetR68_1: R68.1 X1.1(TRI-STATE)
NetR69_1: R69.1 U15.6(REF)
NetR82_2: R82.2 U17.1(DO)

Not connected (* = marked no-connect by the designer): J5 A8(SBU1)* B8(SBU2)*; U14 A4(MGTPTXN0_216) A6(MGTPTXN2_216) A8(MGTPRXN0_216)* A10(MGTPRXN2_216)* AA6(IO_L18N_T2_34) AA8(IO_L22P_T3_34) AA9(IO_L8P_T1_13) AA10(IO_L9P_T1_DQS_13) AA14(IO_L5N_T0_13) AA19(IO_L15P_T2_DQS_RDWR_B_14) AB6(IO_L20N_T3_34) AB7(IO_L20P_T3_34) AB8(IO_L22N_T3_34) AB10(IO_L8N_T1_13) B4(MGTPTXP0_216) B5(MGTAVTT)* B6(MGTPTXP2_216) B7(MGTAVTT)* B8(MGTPRXP0_216)* B9(MGTAVTT)* B10(MGTPRXP2_216)* B11(MGTAVTT)* C4(MGTAVTT)* C5(MGTPTXN1_216) C7(MGTPTXN3_216) C8(MGTAVTT)* C9(MGTPRXN3_216)* C11(MGTPRXN1_216)* C20(IO_L19N_T3_VREF_16)* D5(MGTPTXP1_216) D6(MGTAVCC)* D7(MGTPTXP3_216) D9(MGTPRXP3_216)* D10(MGTAVCC)* D11(MGTPRXP1_216)* D15(IO_L6N_T0_VREF_16)* E3(IO_L6N_T0_VREF_35)* E6(MGTREFCLK0N_216)* E8(MGTAVCC)* E10(MGTREFCLK1N_216)* E21(IO_L23P_T3_16) F4(IO_0_35)* F6(MGTREFCLK0P_216)* F7(MGTAVCC)* F8(MGTRREF_216)* F9(MGTAVCC)* F10(MGTREFCLK1P_216)* F15(IO_0_16)* F21(IO_25_16)* G4(IO_L12N_T1_MRCC_35)* G22(IO_L24N_T3_16) H18(IO_L6N_T0_VREF_15)* J16(IO_0_15)* K14(IO_L19N_T3_A21_VREF_15)* L4(IO_L18N_T2_35)* L6(IO_25_35)* M17(IO_25_15)* N3(IO_L19N_T3_VREF_35)* N15(IO_25_14) P14(IO_L19P_T3_A10_D26_14) P20(IO_0_14) R4(IO_L13P_T2_MRCC_34) R14(IO_L19N_T3_A09_D25_VREF_14) R18(IO_L20P_T3_A08_D24_14) R19(IO_L5N_T0_D07_14) T1(IO_L1P_T0_34) T3(IO_0_34)* T4(IO_L13N_T2_MRCC_34) T6(IO_L17N_T2_34) T14(IO_L15P_T2_DQS_13) T15(IO_L15N_T2_DQS_13) T16(IO_L17P_T2_13) T18(IO_L20N_T3_A07_D23_14) T20(IO_L6N_T0_D08_VREF_14) U1(IO_L1N_T0_34) U7(IO_25_34)* U15(IO_L14P_T2_SRCC_13) U16(IO_L17N_T2_13) U17(IO_L18P_T2_A12_D28_14) U18(IO_L18N_T2_A11_D27_14) V3(IO_L6N_T0_VREF_34) V7(IO_L19P_T3_34) V8(IO_L21N_T3_DQS_34) V9(IO_L21P_T3_DQS_34) V10(IO_L10P_T1_13) V13(IO_L13P_T2_MRCC_13) V14(IO_L13N_T2_MRCC_13) V15(IO_L14N_T2_SRCC_13) V17(IO_L16P_T2_CSI_B_14) V20(IO_L11N_T1_SRCC_14) W7(IO_L19N_T3_VREF_34) W9(IO_L24P_T3_34) W10(IO_L10N_T1_13) W11(IO_L12P_T1_MRCC_13) W12(IO_L12N_T1_MRCC_13) W14(IO_L6P_T0_13) W17(IO_L16N_T2_A15_D31_14) W20(IO_L12N_T1_MRCC_14) W21(IO_L7P_T1_D09_14) W22(IO_L7N_T1_D10_14) Y2(IO_L4N_T0_34) Y3(IO_L9P_T1_DQS_34) Y7(IO_L23N_T3_34) Y9(IO_L24N_T3_34) Y11(IO_L11P_T1_SRCC_13) Y13(IO_L5P_T0_13) Y17(IO_0_13) Y22(IO_L9N_T1_DQS_D13_14); U15 21(ADBUS4) 22(ADBUS5) 23(ADBUS6) 24(ADBUS7) 26(ACBUS0) 27(ACBUS1) 28(ACBUS2) 30(ACBUS4) 32(ACBUS5) 33(ACBUS6) 34(ACBUS7) 36(~{SUSPEND}) 45(BDBUS6) 48(BCBUS0) 52(BCBUS1) 53(BCBUS2) 57(BCBUS5) 58(BCBUS6) 59(BCBUS7) 60(~{PWREN})

## Layout directives
differential pair: FPGA_USB_D_N, FPGA_USB_D_P
net class FPGA_JTAG: FPGA_TCK0, FPGA_TDI0, FPGA_TDO0, FPGA_TMS0
net class DDR_ADDR: DDR_A0, DDR_A1, DDR_A2, DDR_A3, DDR_A4, DDR_A5, DDR_A6, DDR_A7, DDR_A8, DDR_A9, DDR_A10, DDR_A11, DDR_A12, DDR_A13, DDR_A14, DDR_A15, DDR_BA0, DDR_BA1, DDR_BA2, DDR_CAS, DDR_CKE, DDR_CLK_N, DDR_CLK_P, DDR_CS, DDR_ODT, DDR_RAS, DDR_WE
net class DDR: DDR_A0, DDR_A1, DDR_A2, DDR_A3, DDR_A4, DDR_A5, DDR_A6, DDR_A7, DDR_A8, DDR_A9, DDR_A10, DDR_A11, DDR_A12, DDR_A13, DDR_A14, DDR_A15, DDR_BA0, DDR_BA1, DDR_BA2, DDR_CAS, DDR_CKE, DDR_CLK_N, DDR_CLK_P, DDR_CS, DDR_D0, DDR_D1, DDR_D2, DDR_D3, DDR_D4, DDR_D5, DDR_D6, DDR_D7, DDR_D8, DDR_D9, DDR_D10, DDR_D11, DDR_D12, DDR_D13, DDR_D14, DDR_D15, DDR_D16, DDR_D17, DDR_D18, DDR_D19, DDR_D20, DDR_D21, DDR_D22, DDR_D23, DDR_D24, DDR_D25, DDR_D26, DDR_D27, DDR_D28, DDR_D29, DDR_D30, DDR_D31, DDR_DQM0, DDR_DQM1, DDR_DQM2, DDR_DQM3, DDR_DQS0_N, DDR_DQS0_P, DDR_DQS1_N, DDR_DQS1_P, DDR_DQS2_N, DDR_DQS2_P, DDR_DQS3_N, DDR_DQS3_P, DDR_ODT, DDR_RAS, DDR_WE
differential pair; differential pair class DDR_DIFF: DDR_CLK_N, DDR_CLK_P, DDR_DQS0_N, DDR_DQS0_P, DDR_DQS1_N, DDR_DQS1_P, DDR_DQS2_N, DDR_DQS2_P, DDR_DQS3_N, DDR_DQS3_P
net class DDR_DQ2: DDR_D16, DDR_D17, DDR_D18, DDR_D19, DDR_D20, DDR_D21, DDR_D22, DDR_D23, DDR_DQM2, DDR_DQS2_N, DDR_DQS2_P
net class DDR_DQ3: DDR_D24, DDR_D25, DDR_D26, DDR_D27, DDR_D28, DDR_D29, DDR_D30, DDR_D31, DDR_DQM3, DDR_DQS3_N, DDR_DQS3_P
net class DDR_DQ1: DDR_D8, DDR_D9, DDR_D10, DDR_D11, DDR_D12, DDR_D13, DDR_D14, DDR_D15, DDR_DQM1, DDR_DQS1_N, DDR_DQS1_P
net class DDR_DQ0: DDR_D0, DDR_D1, DDR_D2, DDR_D3, DDR_D4, DDR_D5, DDR_D6, DDR_D7, DDR_DQM0, DDR_DQS0_N, DDR_DQS0_P
net class TileLink: SOC_TL0, SOC_TL1, SOC_TL2, SOC_TL3, SOC_TL4, SOC_TL5, SOC_TL6, SOC_TL7, SOC_TL8, SOC_TL9, SOC_TL10, SOC_TL11, SOC_TL12, SOC_TL13, SOC_TL14, SOC_TL15, SOC_TL16, SOC_TL17, SOC_TL18, SOC_TL19, SOC_TL20, SOC_TL21, SOC_TL22, SOC_TL23, SOC_TL24, SOC_TL25, SOC_TL26, SOC_TL27, SOC_TL28, SOC_TL29, SOC_TL30, SOC_TL31, SOC_TL32, SOC_TL33, SOC_TL34, SOC_TL35, SOC_TL36, SOC_TL37, SOC_TL38, SOC_TL39, SOC_TL40, SOC_TL41, SOC_TL42, SOC_TL43, SOC_TL44, SOC_TL45, SOC_TL46, SOC_TL47, SOC_TL48, SOC_TL49, SOC_TL50, SOC_TL51, SOC_TL52, SOC_TL53, SOC_TL54, SOC_TL55, SOC_TL56, SOC_TL57, SOC_TL58, SOC_TL59, SOC_TL60, SOC_TL61, SOC_TL62, SOC_TL63, SOC_TL64, SOC_TL65, SOC_TL66, SOC_TL67, SOC_TL68, SOC_TL69, SOC_TL70, SOC_TL71, SOC_TL72, SOC_TL73, SOC_TL74, SOC_TL75, SOC_TL76, SOC_TL77, SOC_TL78, SOC_TL79, SOC_TL80, SOC_TL81, SOC_TL82, SOC_TL83, SOC_TL84, SOC_TL85, SOC_TL86, SOC_TL87, SOC_TL88, SOC_TL89
net class FPGA_SPI: FPGA_CCLK, FPGA_CSO, FPGA_DQ0, FPGA_DQ1, FPGA_DQ2, FPGA_DQ3
net class PMOD1: PM_10_N, PM_10_P, PM_11_N, PM_11_P, PM_12_N, PM_12_P, PM_13_N, PM_13_P
net class PMOD0: PM_00_N, PM_00_P, PM_01_N, PM_01_P, PM_02_N, PM_02_P, PM_03_N, PM_03_P
net class FTDI_SPI: FPGA_FTDI0, FPGA_FTDI1, FPGA_FTDI2, FPGA_FTDI3, FPGA_FTDI5, FPGA_UART0_RX, FPGA_UART0_TX
differential pair; differential pair class PCIE_DIFF: PM_10_N, PM_10_P, PM_11_N, PM_11_P, PM_12_N, PM_12_P, PM_13_N, PM_13_P
net class SD Card: SD_CD, SD_CLK, SD_CMD, SD_D0, SD_D1, SD_D2, SD_D3

## Notes on the sheet
- AMD Kintex 7 160T FPGA
- Bank 13
- Bank 14
- Bank 15
- Bank 16
- Bank 34
- Bank 35
- VCCINT
- VCCBRAM
- VCCAUX
- 3.3V Clock for the FPGA
- (in symbol XC7A100T-2FGG484I-2, part A) BANK 13
- (in symbol XC7A100T-2FGG484I-2, part B) BANK 14
- (in symbol XC7A100T-2FGG484I-2, part C) BANK 15
- (in symbol XC7A100T-2FGG484I-2, part D) BANK 16
- (in symbol XC7A100T-2FGG484I-2, part E) BANK 34
- (in symbol XC7A100T-2FGG484I-2, part F) BANK 35

## Library data of the parts
C38 C43-C55 C58-C62 C65-C69 C72-C76 C79-C84 C87-C91 C94 C95 C100-C105 C117 C118 C121-C123 = CMP-104-000122-1: 0402-470n-10%-16V-X5R-AECQ200; Manufacturer Name: Murata; Temp Code: X5R; Voltage Rating: 16V; Capacitor Type: Ceramic; Tolerance: 10%; Design Item ID: CMP-001-00118-4; Case/Package: 0402; Component Type: Standard; Manufacturer Part Number: GRT155R61C474KE01D; Pin Count: 2; Pins: 2; Mounting Technology: Surface Mount; Max Operating Temperature: 85°C; Source: Components - 11.02.26 - 17.26.SchLib; Min Operating Temperature: -55°C; Info: 0402-470n-10%-16V-X5R-AECQ200; JLC PN: C126625
C56 C57 C63 C64 C70 C71 C77 C78 C85 C86 C92 C93 C96-C99 C106-C110 C116 C124-C129 C139 C141 C142 C218 C219 C222 = CMP-104-000119-5: 0402-4.7u-20%-25V-X5R; Manufacturer Name: Murata; Temp Code: X5R; Tolerance: 20%; Capacitor Type: Ceramic; Voltage Rating: 25V; Pin Count: 2; Case/Package: 0402; Mounting Technology: Surface Mount; Source: Components - 11.02.26 - 17.26.SchLib; JLC PN: C2858031; Min Operating Temperature: -55°C; Max Operating Temperature: 85°C; Design Item ID: CMP-001-00116-4; Component Type: Standard; Info: 0402-4.7u-20%-25V-X5R; Pins: 2; Manufacturer Part Number: GRM155R61E475ME15D
C111-C115 C223 C229-C231 = CMP-104-000118-4: 0805-100u-20%-6.3V-X5R; Manufacturer Name: Murata; Voltage Rating: 6.3V; Temp Code: X5R; Capacitor Type: Ceramic; Tolerance: 20%; Design Item ID: CMP-001-00132-1; Source: Components - 11.02.26 - 17.26.SchLib; Min Operating Temperature: -55°C; Info: 0805-100u-20%-6.3V-X5R; Mounting Technology: Surface Mount; JLC PN: C141660; Case/Package: 0805; Component Type: Standard; Pin Count: 2; Max Operating Temperature: 85°C; Manufacturer Part Number: GRM21BR60J107ME15L; Pins: 2
C119 C120 = CMP-104-000120-5: 0402-47n-10%-16V-X7R-AECQ200; Manufacturer Name: Samsung Electro-Mechanics; Capacitor Type: Ceramic; Voltage Rating: 16V; Temp Code: X7R; Tolerance: 10%; Max Operating Temperature: 125°C; Mounting Technology: Surface Mount; Info: 0402-47n-10%-16V-X7R-AECQ200; Component Type: Standard; JLC PN: C307434; Source: Components - 11.02.26 - 17.26.SchLib; Pins: 2; Design Item ID: CMP-001-00118-4; Min Operating Temperature: -55°C; Pin Count: 2; Case/Package: 0402; Manufacturer Part Number: CL05B473KO5NNNC
C130-C136 C138 C140 C143-C145 C147 = CMP-104-000086-6: 0402-100n-10%-16V-X7R-AECQ200; Manufacturer Name: Murata; Capacitor Type: Ceramic; Voltage Rating: 16V; Tolerance: 10%; Temp Code: X7R; Component Type: Standard; Min Operating Temperature: -55°C; Source: Components - 11.02.26 - 17.26.SchLib; Design Item ID: CMP-001-00111-7; Pin Count: 2; Max Operating Temperature: 125°C; Case/Package: 0402; Pins: 2; Info: 0402-100n-10%-16V-X7R-AECQ200; Manufacturer Part Number: CL05B104KO5VPNC; Mounting Technology: Surface Mount; JLC PN: C307332
C137 = CMP-104-000103-5: 0603-10u-10%-16V-X5R-AECQ200; Manufacturer Name: Murata; Tolerance: 10%; Voltage Rating: 16V; Capacitor Type: Ceramic; Design Item ID: CMP-001-00130-1; Min Operating Temperature: -55°C; Source: Components - 11.02.26 - 17.26.SchLib; Info: 0603-10u-10%-16V-X5R-AECQ200; Mounting Technology: Surface Mount; Pin Count: 2; Pins: 2; Manufacturer Part Number: GRT188R61C106KE13J; Max Operating Temperature: 85°C; Component Type: Standard; Case/Package: 0603; JLC PN: C3888097
C146 = CMP-104-000087-6: 0402-1u-10%-16V-X6S-AECQ200; Manufacturer Name: Murata; Temp Code: X6S; Voltage Rating: 16V; Capacitor Type: Ceramic; Tolerance: 10%; Min Operating Temperature: -55°C; Pin Count: 2; Design Item ID: CMP-001-00112-5; Manufacturer Part Number: GRT155C81C105KE13J; Info: 0402-1u-10%-16V-X6S-AECQ200; Mounting Technology: Surface Mount; Component Type: Standard; Case/Package: 0402; Source: Components - 11.02.26 - 17.26.SchLib; Max Operating Temperature: 105°C; Pins: 2; JLC PN: C908010
C232 = CMP-104-000104-6: 0402-100n-10%-25V-X7R-AECQ200; Manufacturer Name: Samsung; Capacitor Type: Ceramic; Voltage Rating: 25V; Tolerance: 10%; Temp Code: X7R; Min Operating Temperature: -55°C; Component Type: Standard; Max Operating Temperature: 125°C; Case/Package: 0402; Info: 0402-100n-10%-25V-X7R-AECQ200; Pins: 2; Pin Count: 2; Mounting Technology: Surface Mount; Manufacturer Part Number: CL05B104KA54PNC; Design Item ID: CMP-001-00131-1; Source: Components - 11.02.26 - 17.26.SchLib; JLC PN: C346180
D2 = CMP-090-000051-3: DO214AA-UNI-SCHOTTKY-60V-3A-590mV; Manufacturer Name: STMicroelectronics; Forward Current: 3A; Max Reverse Leakage Current: 150µA; Forward Voltage: 590mV; Reverse Standoff Voltage: 60V; Min Operating Temperature: -65°C; Max Operating Temperature: 150°C; Info: DO214AA-UNI-SCHOTTKY-60V-3A-590mV; JLC PN: C132769; Case/Package: DO-214AA, SMB; Mounting Technology: Surface Mount; Manufacturer Part Number: STPS3L60U
F1 = CMP-008-000013-1: PTC Resettable Fuse 1.5A(hold) 3A(trip) 8VDC 100A 0.8W 0.3s 0.04Ohm SMD Solder Pad 1206 T/R; Manufacturer Name: Littelfuse; Power Dissipation: 800mW; Voltage Rating (DC): 8V; Time to Trip: 300ms; Approvals: TUV, cULus; Minimum Resistance Initial (Rmin): 40mΩ; Max Power Dissipation: 600mW; Value: 40mΩ; Maximum Resistance 1 Hour (R1max): 120mΩ; Max Operating Temperature: 85°C; Working Voltage: 8V; Number of Terminals: 2; Packaging: Cut Tape; Lifecycle Status: Production; Min Operating Temperature: -40°C; Height: 1mm; Hold Current: 1.5A; Operating Supply Voltage: 8V; Trip Current: 3A; Max Voltage Rating (DC): 8V; JLC PN: C118413; Current Rating: 100A; Width: 1.8mm; Case/Package: 1206; RoHS: Compliant; Voltage Rating: 8V; China RoHS: Compliant; Termination: SMD/SMT; Mounting Technology: Surface Mount; Case Code (Metric): 3216; Case Code (Imperial): 1206; Terminal Material: Copper; Lead Free: Lead Free; Manufacturer Part Number: 1206L150THWR; Ambient Temperature Range High: 85°C; REACH SVHC: Yes; Max Current Rating: 100A
FB4 FB5 = CMP-009-000012-2: Ferrite Beads Multi-Layer 600Ohm 25% 100MHz 500mA 380mOhm DCR 0603 Automotive Paper T/R; Manufacturer Name: Murata Electronics; Impedance: 600Ω; DC Resistance (DCR): 380mΩ; Frequency: 100MHz; JLC PN: C19330; Max Operating Temperature: 125°C; Current Rating: 500mA; Tolerance: 25%; Case/Package: 0603; Min Operating Temperature: -55°C; Manufacturer Part Number: BLM18AG601SN1D
J5 = CMP-055-000103-3: Receptacle, 16 Position, 1-Row SMT, without Rear Shield, Shell-DIP Length 1.2mm; Manufacturer Name: JAE Electronics; JLC PN: C3197625; Manufacturer Part Number: DX07S016JA3R1500
LED11-LED14 = CMP-132-000002-2: LED yellow green 0603 wavelength 569nm light intensity 12mcd Front Mounting; Manufacturer Name: Lite-On; Power Rating: 100mW; Viewing Angle: 130°; Forward Current: 30mA; Forward Voltage: 2.6V; Wavelength: 569nm; Pins: 2; Case/Package: 0603; Manufacturer Part Number: LTST-C191GKT; Min Operating Temperature: -55°C; Max Operating Temperature: 85°C; JLC PN: C99289; Mounting Technology: Surface Mount; Color: Green
R63 R70 R79-R81 = CMP-014-000077-5: 0402-10k-1%-1/16W-AEC-Q200; Manufacturer Name: YAGEO; Tolerance: 1%; Voltage Rating: 50V; Power: 63mW; Pins: 2; Source: Components - 11.02.26 - 17.27.SchLib; Manufacturer Part Number: AC0402FR-0710KL; Info: 0402-10k-1%-1/16W-AEC-Q200; Min Operating Temperature: -55°C; Pin Count: 2; Case/Package: 0402; Design Item ID: CMP-009-00191-3; Max Operating Temperature: 155°C; Component Type: Standard; Mounting Technology: Surface Mount; JLC PN: C144807
R64 R65 R68 = CMP-014-000082-5: 0402-4.7k-1%-1/16W-AEC-Q200; Manufacturer Name: YAGEO; Tolerance: 1%; Power: 63mW; Voltage Rating: 50V; Component Type: Standard; Source: Components - 11.02.26 - 17.27.SchLib; Min Operating Temperature: -55°C; Mounting Technology: Surface Mount; Design Item ID: CMP-009-00196-1; Manufacturer Part Number: AC0402FR-074K7L; Max Operating Temperature: 155°C; Pins: 2; Case/Package: 0402; Pin Count: 2; Info: 0402-4.7k-1%-1/16W-AEC-Q200; JLC PN: C174364
R66 R67 = CMP-014-000078-5: 0402-1k-1%-1/16W-AEC-Q200; Manufacturer Name: YAGEO; Voltage Rating: 50V; Power: 63mW; Tolerance: 1%; Manufacturer Part Number: AC0402FR-071KL; Pins: 2; Min Operating Temperature: -55°C; Max Operating Temperature: 155°C; Case/Package: 0402; Pin Count: 2; Source: Components - 11.02.26 - 17.27.SchLib; Mounting Technology: Surface Mount; Design Item ID: CMP-009-00192-1; Info: 0402-1k-1%-1/16W-AEC-Q200; Component Type: Standard; JLC PN: C144789
R69 = CMP-014-000118-4: 0402-12k-1%-1/16W-AEC-Q200; Manufacturer Name: YAGEO; Voltage Rating: 50V; Power: 63mW; Tolerance: 1%; Source: Components - 11.02.26 - 17.27.SchLib; Info: 0402-12k-1%-1/16W-AEC-Q200; Min Operating Temperature: -55°C; Case/Package: 0402; Design Item ID: CMP-009-00210-1; Mounting Technology: Surface Mount; Pins: 2; Manufacturer Part Number: AC0402FR-0712KL; Max Operating Temperature: 155°C; JLC PN: C144798
R71 = CMP-014-000121-4: 0402-620-1%-1/16W-AEC-Q200; Manufacturer Name: YAGEO; Voltage Rating: 50V; Tolerance: 1%; Power: 63mW; Source: Components - 11.02.26 - 17.27.SchLib; Pins: 2; Manufacturer Part Number: AC0402FR-07620RL; Case/Package: 0402; Min Operating Temperature: -55°C; Max Operating Temperature: 155°C; Design Item ID: CMP-009-00210-1; Mounting Technology: Surface Mount; Info: 0402-620-1%-1/16W-AEC-Q200; JLC PN: C144743
R72 R73 = CMP-014-000083-5: 0402-5.1k-1%-1/16W-AEC-Q200; Manufacturer Name: YAGEO; Tolerance: 1%; Voltage Rating: 50V; Power: 63mW; Source: Components - 11.02.26 - 17.27.SchLib; Max Operating Temperature: 155°C; Pins: 2; Manufacturer Part Number: AC0402FR-075K1L; Info: 0402-5.1k-1%-1/16W-AEC-Q200; Pin Count: 2; Mounting Technology: Surface Mount; Case/Package: 0402; Design Item ID: CMP-009-00197-1; Min Operating Temperature: -55°C; Component Type: Standard; JLC PN: C144745
R74 R75 = CMP-014-000120-4: 0402-27-1%-1/16W-AEC-Q200; Manufacturer Name: YAGEO; Tolerance: 1%; Voltage Rating: 50V; Power: 63mW; Mounting Technology: Surface Mount; Info: 0402-27-1%-1/16W-AEC-Q200; Pins: 2; Source: Components - 11.02.26 - 17.27.SchLib; Max Operating Temperature: 155°C; Manufacturer Part Number: AC0402FR-0727RL; Design Item ID: CMP-009-00210-1; Min Operating Temperature: -55°C; Case/Package: 0402; JLC PN: C226392
R76-R78 = CMP-014-000119-4: 0402-750-1%-1/16W-AEC-Q200; Manufacturer Name: YAGEO; Voltage Rating: 50V; Tolerance: 1%; Power: 63mW; Min Operating Temperature: -55°C; Pins: 2; Design Item ID: CMP-009-00210-1; Case/Package: 0402; Mounting Technology: Surface Mount; Source: Components - 11.02.26 - 17.27.SchLib; Info: 0402-750-1%-1/16W-AEC-Q200; Manufacturer Part Number: AC0402FR-07750RL; Max Operating Temperature: 155°C; JLC PN: C227221
R82 = CMP-014-000107-4: 0402-2k-1%-1/16W-AEC-Q200; Manufacturer Name: YAGEO; Voltage Rating: 50V; Tolerance: 1%; Power: 63mW; Max Operating Temperature: 155°C; Mounting Technology: Surface Mount; Case/Package: 0402; Component Type: Standard; Source: Components - 11.02.26 - 17.27.SchLib; Min Operating Temperature: -55°C; Info: 0402-2k-1%-1/16W-AEC-Q200; Design Item ID: CMP-009-00190-1; Pins: 2; Manufacturer Part Number: AC0402FR-072KL; Pin Count: 2; JLC PN: C144770
SW5 = CMP-015-000062-1: Switch Tactile N.O. SPST Round Button Gull Wing 0.05A 12VDC 1.5N SMD Embossed T/R; Manufacturer Name: Omron; Contact Resistance: 100mΩ; Switch Function: Off-Mom; Max Current Rating: 50mA; Voltage Rating (DC): 12V; Switch Type: SPST; Max Operating Temperature: 70°C; Manufacturer Part Number: B3U-1000P-B; Mounting Technology: Surface Mount; JLC PN: C231329; Min Operating Temperature: -25°C
U14 = XC7A100T-2FGG484I-2: ARTIX-7 FPGA Field Programmable Gate Array, 7925 CLBs, 1098MHz, 101440-Cell, CMOS, PBGA484; Manufacturer Name: AMD; Clock Frequency: 1.286GHz; Number of Logic Blocks (LABs): 7925; Max Supply Voltage: 1.05V; Number of Logic Elements/Cells: 101440; Min Supply Voltage: 950mV; Operating Supply Voltage: 1V; Max Operating Temperature: 100°C; Case/Package: FBGA; Pins: 484; Terminal Pitch: 1mm; JLC PN: C1521767; Manufacturer Part Number: XC7A100T-1FGG484C; Min Operating Temperature: -40°C
U15 = CMP-051-000002-4: USB Hi-Speed to Dual Channel Serial UART/FIFO/JTAG/SPI/I2C IC - LQFP-64; Manufacturer Name: FTDI; Operating Supply Current: 70mA; Data Rate: 60Mbps; Pin Count: 64; Source: FT2232HL-REEL.SchLib; Design Item ID: FT2232HL-REEL; Min Operating Temperature: -40°C; JLC PN: C27882; Case/Package: LQFP-64; Max Operating Temperature: 85°C; Manufacturer Part Number: FT2232HL-REEL
U16 = CMP-051-000050-3: NOR Flash Serial (SPI, Dual SPI, Quad SPI) 2.5V/3V/3.3V 128M-bit 16M x 8 8ns 8-Pin SOIC T/R; Manufacturer Name: ISSI; Min Supply Voltage: 2.3V; Max Supply Voltage: 3.6V; Type: Type; Pins: 8; Min Operating Temperature: -40°C; RefDes: RefDes; Case/Package: SOIC; Memory Format: FLASH; JLC PN: C521290; Copyright: Copyright (C) 2025 Ultra Librarian. All rights reserved.; Max Operating Temperature: 105°C; Design Item ID: IS25LP128-JBLE-TR; Source: IS25LP128-JBLE-TR.SchLib; Manufacturer Part Number: IS25LP128-JBLE-TR
U17 = CMP-051-000048-2: Microwire Serial EEPROM Family, 2.5Vto 5.5V' 2 MHz, -40°Cto 125°C, SOT-23-6, RoHS; Manufacturer Name: Microchip; Max Supply Voltage: 5.5V; Interface: SPI; Min Supply Voltage: 2.5V; Memory Size: 256B; Height: 1.45mm; Min Operating Temperature: -40°C; Max Operating Temperature: 85°C; Case/Package: SOT-23; Memory Format: EEPROM; JLC PN: C190271; Mounting Technology: Surface Mount; Pins: 6; Manufacturer Part Number: 93LC56BT-I/OT
X1 = CMP-013-000002-2: 1.8V~3.3V ±10ppm ±20ppm CMOS 50MHz SMD3225-4P; Manufacturer Name: YXC Technologies; Design Item ID: OT2EL4C4JI-111OLP-50M; Manufacturer Part Number: OT2EL4C4JI-111OLP-50M; JLC PN: C5203552; Source: BWRC.SchLib
X2 = CMP-005-000017-2: Ceramic Resonator 12MHz ±0.5% (Tol) ±0.2% (Stability) 33pF 30Ohm 3-Pin CSMD T/R; Manufacturer Name: Murata Electronics; ESR (Equivalent Series Resistance): 30Ω; Frequency Stability: 2000ppm; Mounting Technology: Surface Mount; Frequency: 12MHz; Load Capacitance: 33pF; Manufacturer Part Number: CSTNE12M0G550000R0; JLC PN: C341520; Max Operating Temperature: 85°C; Design Item ID: CSTNE12M0G550000R0; Frequency Tolerance: 0.5%; Min Operating Temperature: -40°C; Source: CSTNE12M0G550000R0.SchLib